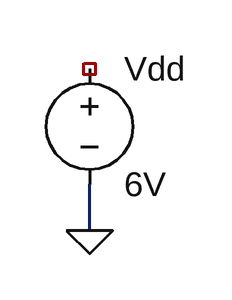
[diagram p0: schematic Draft1.asc]
Draft1.asc, the LTspice schematic file:
Version 4.1
SHEET 1 880 680
WIRE 48 192 48 160
FLAG 48 192 0
SYMBOL voltage 48 64 R0
SYMATTR InstName Vdd
SYMATTR Value 6V

The netlist it stands for:
* Draft1.asc
Vdd NC_01 0 6V
.backanno
.end